# EAGLE design ProtoCard-Prod-V1.0 (EAGLE 7.6.0)
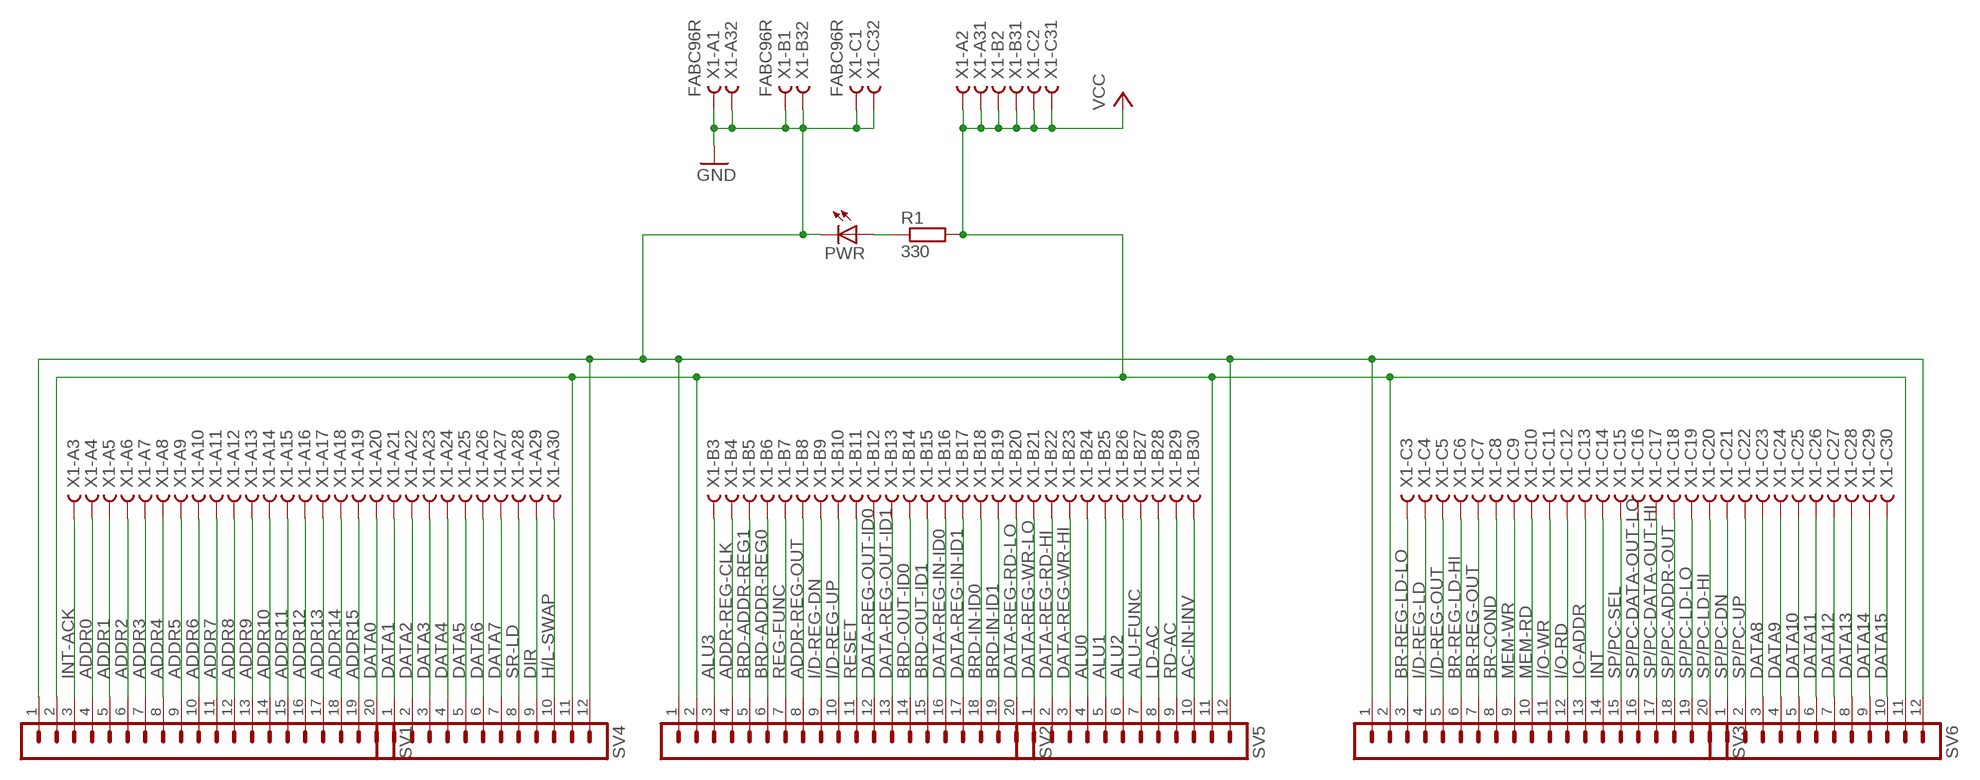
[diagram p0: schematic, sheet 1]

## Parts
PWR  LED5MM  [LED5MM]
R1  330  R0207/10  [0207/10]
SV1  MA20-1  [MA20-1]
SV2  MA20-1  [MA20-1]
SV3  MA20-1  [MA20-1]
SV4  MA12-1  [MA12-1]
SV5  MA12-1  [MA12-1]
SV6  MA12-1  [MA12-1]
X1  FABC96R  [FABC96R]

## Nets
AC-IN-INV: SV5.10 X1.B30
ADDR0: SV1.4 X1.A4
ADDR1: SV1.5 X1.A5
ADDR2: SV1.6 X1.A6
ADDR3: SV1.7 X1.A7
ADDR4: SV1.8 X1.A8
ADDR5: SV1.9 X1.A9
ADDR6: SV1.10 X1.A10
ADDR7: SV1.11 X1.A11
ADDR8: SV1.12 X1.A12
ADDR9: SV1.13 X1.A13
ADDR10: SV1.14 X1.A14
ADDR11: SV1.15 X1.A15
ADDR12: SV1.16 X1.A16
ADDR13: SV1.17 X1.A17
ADDR14: SV1.18 X1.A18
ADDR15: SV1.19 X1.A19
ADDR-REG-CLK: SV2.4 X1.B4
ADDR-REG-OUT: SV2.8 X1.B8
ALU0: SV5.4 X1.B24
ALU1: SV5.5 X1.B25
ALU2: SV5.6 X1.B26
ALU3: SV2.3 X1.B3
ALU-FUNC: SV5.7 X1.B27
BR-COND: SV3.8 X1.C8
BR-REG-LD-HI: SV3.6 X1.C6
BR-REG-LD-LO: SV3.3 X1.C3
BR-REG-OUT: SV3.7 X1.C7
BRD-ADDR-REG0: SV2.6 X1.B6
BRD-ADDR-REG1: SV2.5 X1.B5
BRD-IN-ID0: SV2.18 X1.B18
BRD-IN-ID1: SV2.19 X1.B19
BRD-OUT-ID0: SV2.14 X1.B14
BRD-OUT-ID1: SV2.15 X1.B15
DATA0: SV1.20 X1.A20
DATA1: SV4.1 X1.A21
DATA2: SV4.2 X1.A22
DATA3: SV4.3 X1.A23
DATA4: SV4.4 X1.A24
DATA5: SV4.5 X1.A25
DATA6: SV4.6 X1.A26
DATA7: SV4.7 X1.A27
DATA8: SV6.3 X1.C23
DATA9: SV6.4 X1.C24
DATA10: SV6.5 X1.C25
DATA11: SV6.6 X1.C26
DATA12: SV6.7 X1.C27
DATA13: SV6.8 X1.C28
DATA14: SV6.9 X1.C29
DATA15: SV6.10 X1.C30
DATA-REG-IN-ID0: SV2.16 X1.B16
DATA-REG-IN-ID1: SV2.17 X1.B17
DATA-REG-OUT-ID0: SV2.12 X1.B12
DATA-REG-OUT-ID1: SV2.13 X1.B13
DATA-REG-RD-HI: SV5.2 X1.B22
DATA-REG-RD-LO: SV2.20 X1.B20
DATA-REG-WR-HI: SV5.3 X1.B23
DATA-REG-WR-LO: SV5.1 X1.B21
DIR: SV4.9 X1.A29
GND: PWR.K(C) SV1.1 SV2.1 SV3.1 SV4.12 SV5.12 SV6.12 X1.A1 X1.A32 X1.B1 X1.B32 X1.C1 X1.C32
H/L-SWAP: SV4.10 X1.A30
I/D-REG-DN: SV2.9 X1.B9
I/D-REG-LD: SV3.4 X1.C4
I/D-REG-OUT: SV3.5 X1.C5
I/D-REG-UP: SV2.10 X1.B10
I/O-RD: SV3.12 X1.C12
I/O-WR: SV3.11 X1.C11
INT: SV3.14 X1.C14
INT-ACK: SV1.3 X1.A3
IO-ADDR: SV3.13 X1.C13
LD-AC: SV5.8 X1.B28
MEM-RD: SV3.10 X1.C10
MEM-WR: SV3.9 X1.C9
N$10: PWR.A R1.1
RD-AC: SV5.9 X1.B29
REG-FUNC: SV2.7 X1.B7
RESET: SV2.11 X1.B11
SP/PC-ADDR-OUT: SV3.18 X1.C18
SP/PC-DATA-OUT-HI: SV3.17 X1.C17
SP/PC-DATA-OUT-LO: SV3.16 X1.C16
SP/PC-DN: SV6.1 X1.C21
SP/PC-LD-HI: SV3.20 X1.C20
SP/PC-LD-LO: SV3.19 X1.C19
SP/PC-SEL: SV3.15 X1.C15
SP/PC-UP: SV6.2 X1.C22
SR-LD: SV4.8 X1.A28
VCC: R1.2 SV1.2 SV2.2 SV3.2 SV4.11 SV5.11 SV6.11 X1.A2 X1.A31 X1.B2 X1.B31 X1.C2 X1.C31

## Library data of the parts
PWR = led:LED: LED OSRAM: - CHIPLED LG R971, LG N971, LY N971, LG Q971, LY Q971, LO R971, LY R971 LH N974, LH R974 LS Q976, LO Q976, LY Q976 LO Q996 - Hyper CHIPLED LW Q18S LB Q993, LB Q99A, LB R99A - SideLED LS A670, LO A670, LY A670, LG A670, LP A670 LB A673, LV A673, LT A673, LW A673 LH A674 LY A675 LS A676, LA A676, LO A676, LY A676, LW A676 LS A679, LY A679, LG A679 - Hyper Micro SIDELED® LS Y876, LA Y876, LO Y876, LY Y876 LT Y87S - SmartLED LW L88C, LW L88S LB L89C, LB L89S, LG L890 LS L89K, LO L89K, LY L89K LS L896, LA L896, LO L896, LY L896 - TOPLED LS T670, LO T670, LY T670, LG T670, LP T670 LSG T670, LSP T670, LSY T670, LOP T670, LYG T670 LG T671, LOG T671, LSG T671 LB T673, LV T673, LT T673, LW T673 LH T674 LS T676, LA T676, LO T676, LY T676, LB T676, LH T676, LSB T676, LW T676 LB T67C, LV T67C, LT T67C, LS T67K, LO T67K, LY T67K, LW E67C LS E67B, LA E67B, LO E67B, LY E67B, LB E67C, LV E67C, LT E67C LW T67C LS T679, LY T679, LG T679 LS T770, LO T770, LY T770, LG T770, LP T770 LB T773, LV T773, LT T773, LW T773 LH T774 LS E675, LA E675, LY E675, LS T675 LS T776, LA T776, LO T776, LY T776, LB T776 LHGB T686 LT T68C, LB T68C - Hyper Mini TOPLED® LB M676 - Mini TOPLED Santana® LG M470 LS M47K, LO M47K, LY M47K Source: http://www.osram.convergy.de LUXEON: - LUMILED® LXK2-PW12-R00, LXK2-PW12-S00, LXK2-PW14-U00, LXK2-PW14-V00 LXK2-PM12-R00, LXK2-PM12-S00, LXK2-PM14-U00 LXK2-PE12-Q00, LXK2-PE12-R00, LXK2-PE12-S00, LXK2-PE14-T00, LXK2-PE14-U00 LXK2-PB12-K00, LXK2-PB12-L00, LXK2-PB12-M00, LXK2-PB14-N00, LXK2-PB14-P00, LXK2-PB14-Q00 LXK2-PR12-L00, LXK2-PR12-M00, LXK2-PR14-Q00, LXK2-PR14-R00 LXK2-PD12-Q00, LXK2-PD12-R00, LXK2-PD12-S00 LXK2-PH12-R00, LXK2-PH12-S00 LXK2-PL12-P00, LXK2-PL12-Q00, LXK2-PL12-R00 Source: www.luxeon.com KINGBRIGHT: KA-3528ASYC Source: www.kingbright.com
R1 = eagle-ltspice:R: RESISTOR, European symbol; SPICEMODEL: NONE; SPICEPREFIX: R
SV1-SV3 = con-lstb:MA20-1: PIN HEADER; OC_FARNELL: unknown; OC_NEWARK: unknown
SV4-SV6 = con-lstb:MA12-1: PIN HEADER; OC_FARNELL: unknown; OC_NEWARK: unknown
X1 = con-vg:FABC96R: CONNECTOR female, 96 pins, type R, rows ABC, grid 2.54 mm

## Board
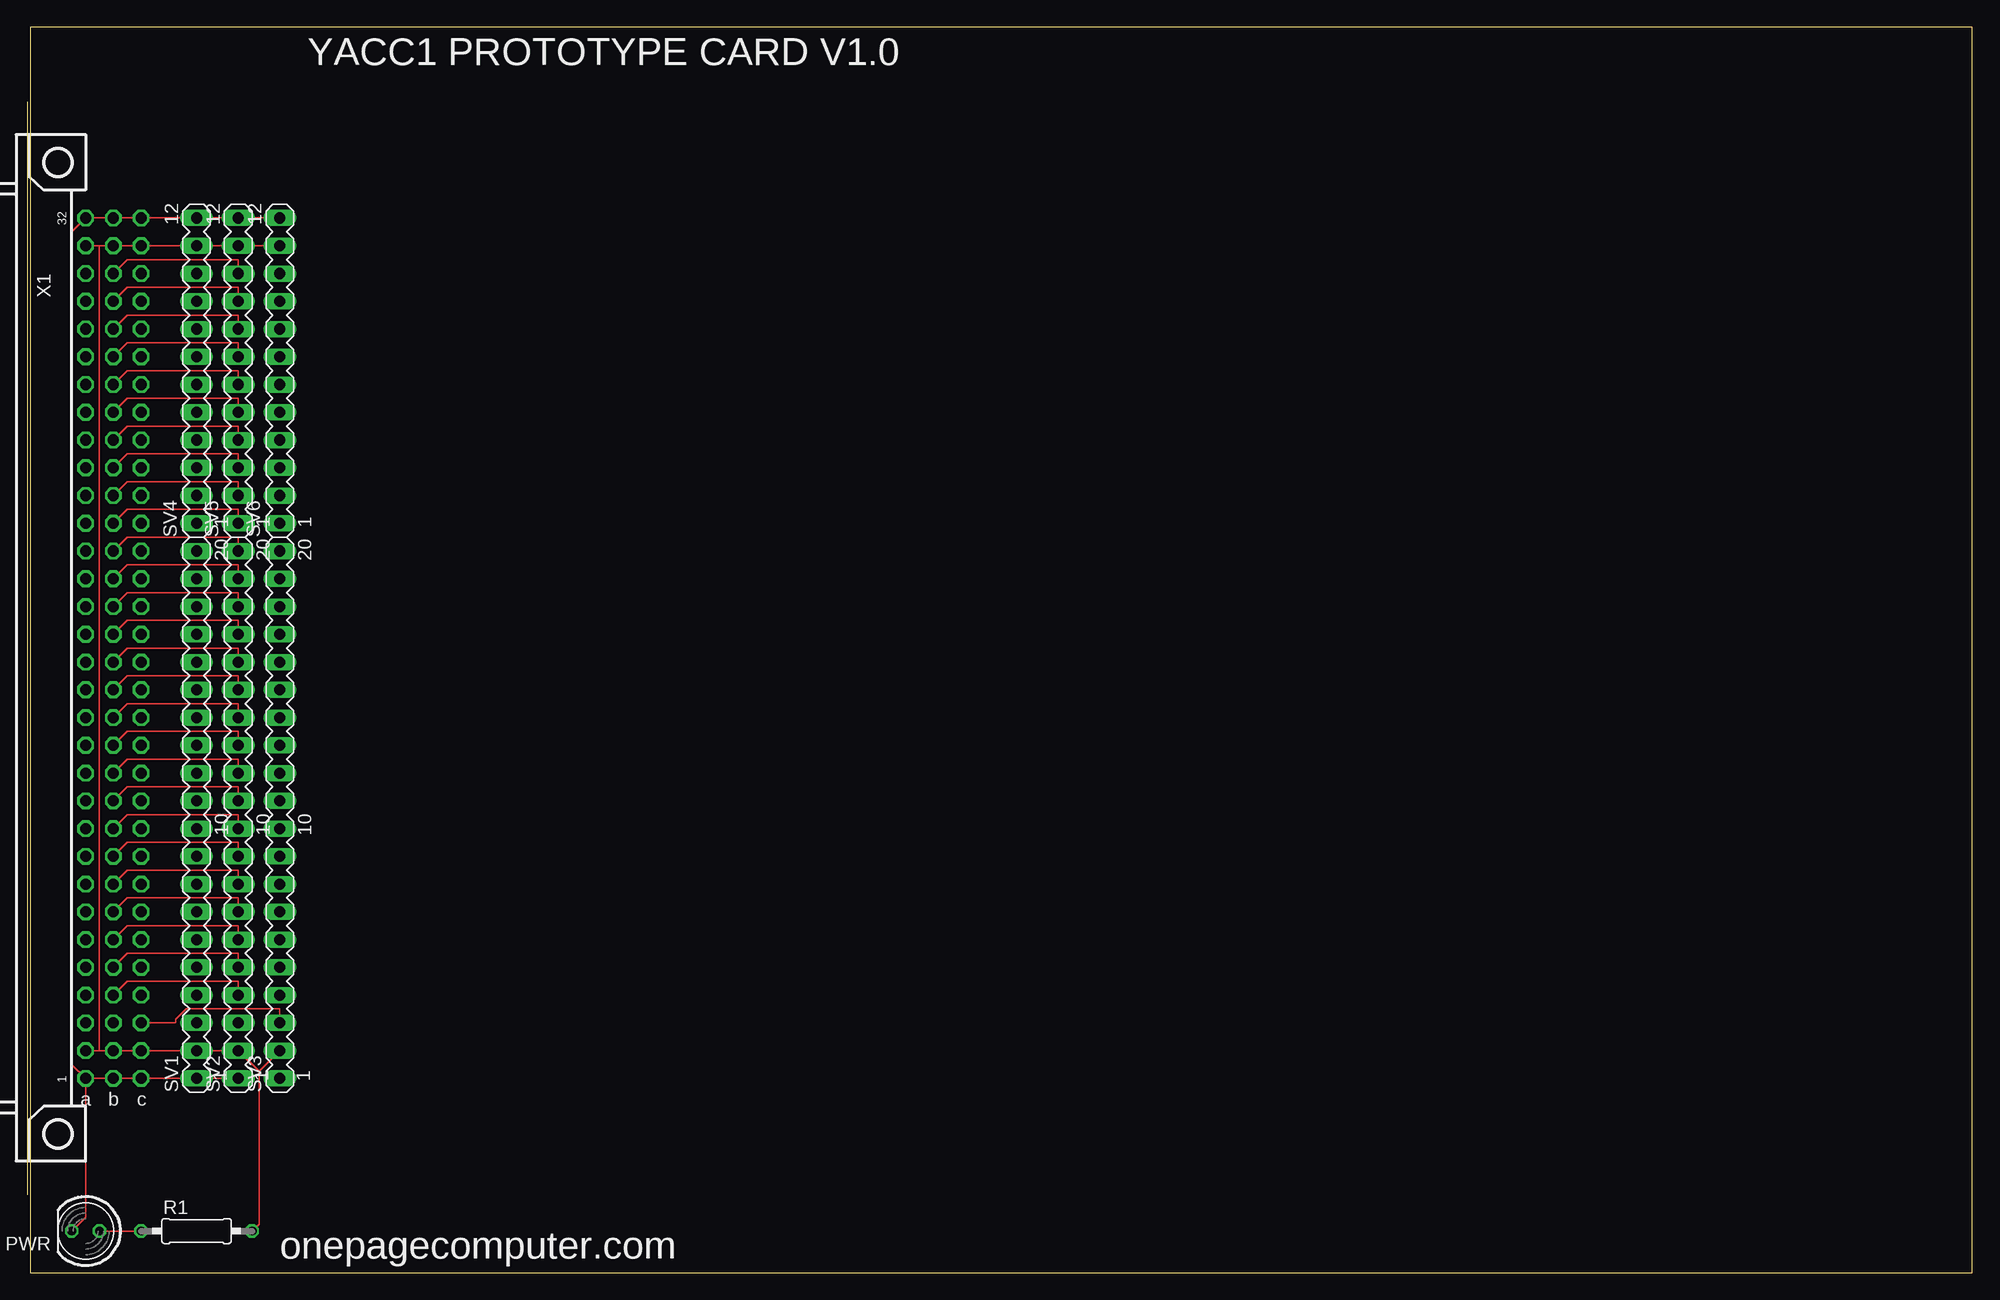
[diagram p1: board, top side]
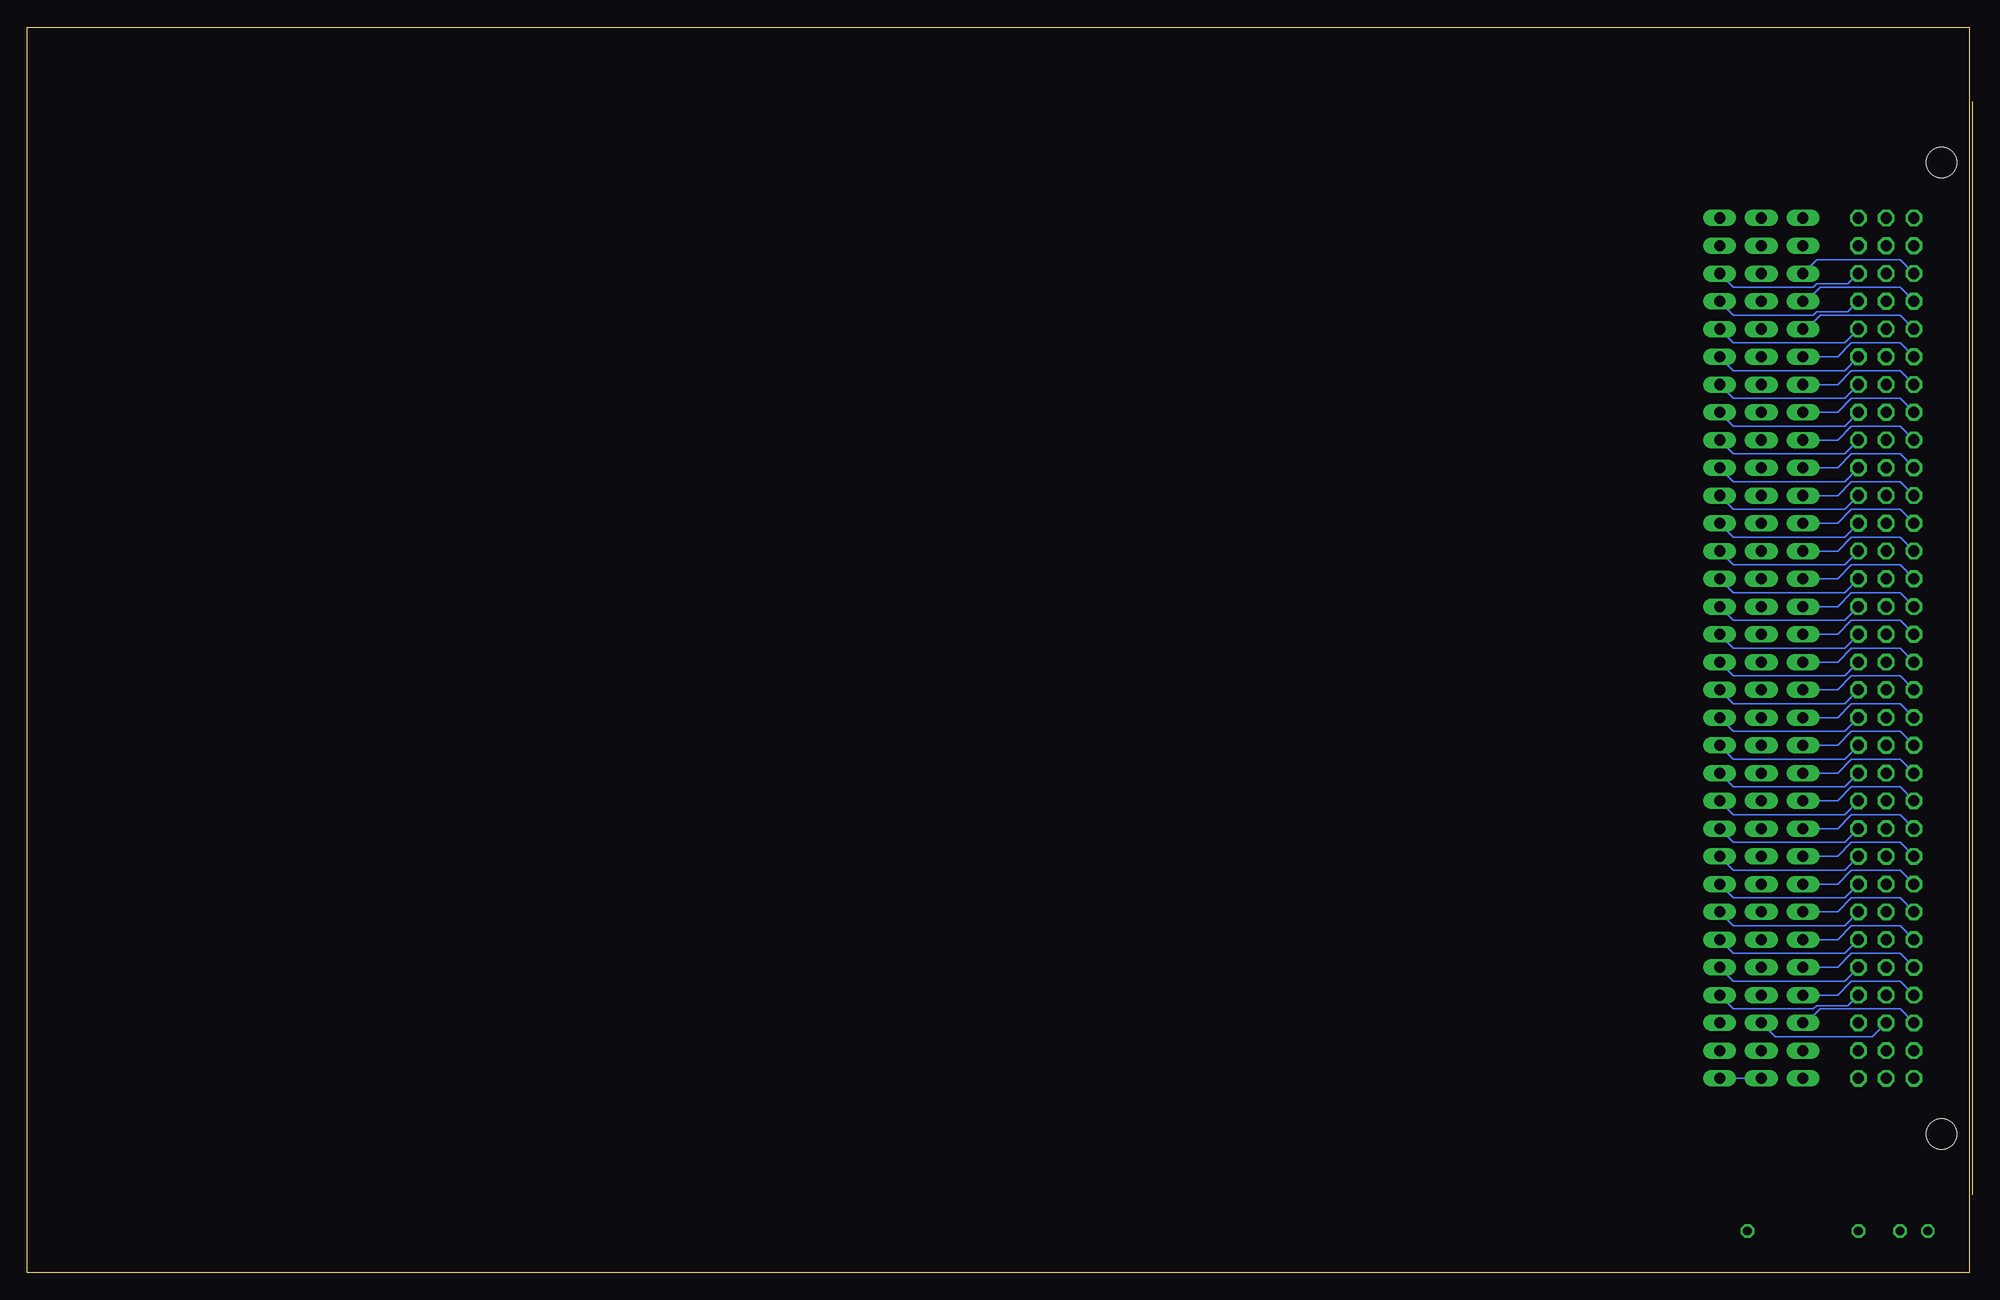
[diagram p2: board, bottom side, seen from below]

Size 177.78 x 113.97 mm. Coordinates in mm from the lower left corner, seen from the top.
Outline: 0,0 177.78,0 177.78,113.97 0,113.97 0,0
Copper layers (1*16): Top 0.0356mm / dielectric 1.5011mm / Bottom 0.0356mm
Design rules "LaenPCBOrder": minimum track width 6mil, minimum drill 13mil, track to track 6mil, track to pad 6mil, pad to pad 6mil, via to via 6mil, smd to smd 6mil, copper to edge 15mil, drill to drill 6mil, minimum pad ring 7mil, minimum via ring 7mil, stop-mask expansion 3mil, vias tented up to drill 0mil, thermal gap 10mil

### Footprints (pad centres in the part's own frame; a part is rotated, then mirrored left to right if it is on the bottom)
LED5MM = drill 0.813 octagon: A -1.27,0; K 1.27,0
0207/10 = drill 0.813 octagon: 1 -5.08,0; 2 5.08,0
MA20-1 = drill 1.016 long: 1 -24.13,0; 2 -21.59,0; 3 -19.05,0; 4 -16.51,0; 5 -13.97,0; 6 -11.43,0; 7 -8.89,0; 8 -6.35,0; 9 -3.81,0; 10 -1.27,0; 11 1.27,0; 12 3.81,0; 13 6.35,0; 14 8.89,0; 15 11.43,0; 16 13.97,0; 17 16.51,0; 18 19.05,0; 19 21.59,0; 20 24.13,0
MA12-1 = drill 1.016 long: 1 -13.97,0; 2 -11.43,0; 3 -8.89,0; 4 -6.35,0; 5 -3.81,0; 6 -1.27,0; 7 1.27,0; 8 3.81,0; 9 6.35,0; 10 8.89,0; 11 11.43,0; 12 13.97,0
FABC96R = drill 1.016 octagon: A1 -2.54,39.37; A2 -2.54,36.83; A3 -2.54,34.29; A4 -2.54,31.75; A5 -2.54,29.21; A6 -2.54,26.67; A7 -2.54,24.13; A8 -2.54,21.59; A9 -2.54,19.05; A10 -2.54,16.51; A11 -2.54,13.97; A12 -2.54,11.43; A13 -2.54,8.89; A14 -2.54,6.35; A15 -2.54,3.81; A16 -2.54,1.27; A17 -2.54,-1.27; A18 -2.54,-3.81; A19 -2.54,-6.35; A20 -2.54,-8.89; A21 -2.54,-11.43; A22 -2.54,-13.97; A23 -2.54,-16.51; A24 -2.54,-19.05; A25 -2.54,-21.59; A26 -2.54,-24.13; A27 -2.54,-26.67; A28 -2.54,-29.21; A29 -2.54,-31.75; A30 -2.54,-34.29; A31 -2.54,-36.83; A32 -2.54,-39.37; B1 -5.08,39.37; B2 -5.08,36.83; B3 -5.08,34.29; B4 -5.08,31.75; B5 -5.08,29.21; B6 -5.08,26.67; B7 -5.08,24.13; B8 -5.08,21.59; B9 -5.08,19.05; B10 -5.08,16.51; B11 -5.08,13.97; B12 -5.08,11.43; B13 -5.08,8.89; B14 -5.08,6.35; B15 -5.08,3.81; B16 -5.08,1.27; B17 -5.08,-1.27; B18 -5.08,-3.81; B19 -5.08,-6.35; B20 -5.08,-8.89; B21 -5.08,-11.43; B22 -5.08,-13.97; B23 -5.08,-16.51; B24 -5.08,-19.05; B25 -5.08,-21.59; B26 -5.08,-24.13; B27 -5.08,-26.67; B28 -5.08,-29.21; B29 -5.08,-31.75; B30 -5.08,-34.29; B31 -5.08,-36.83; B32 -5.08,-39.37; C1 -7.62,39.37; C2 -7.62,36.83; C3 -7.62,34.29; C4 -7.62,31.75; C5 -7.62,29.21; C6 -7.62,26.67; C7 -7.62,24.13; C8 -7.62,21.59; C9 -7.62,19.05; C10 -7.62,16.51; C11 -7.62,13.97; C12 -7.62,11.43; C13 -7.62,8.89; C14 -7.62,6.35; C15 -7.62,3.81; C16 -7.62,1.27; C17 -7.62,-1.27; C18 -7.62,-3.81; C19 -7.62,-6.35; C20 -7.62,-8.89; C21 -7.62,-11.43; C22 -7.62,-13.97; C23 -7.62,-16.51; C24 -7.62,-19.05; C25 -7.62,-21.59; C26 -7.62,-24.13; C27 -7.62,-26.67; C28 -7.62,-29.21; C29 -7.62,-31.75; C30 -7.62,-34.29; C31 -7.62,-36.83; C32 -7.62,-39.37 | hole 2.794: 0,-44.456; 0,44.456

### Placement (x,y rotation side)
PWR  5.08,3.81 180 top
R1  15.24,3.81 0 top
SV1  15.24,41.91 90 top
SV2  19.05,41.91 90 top
SV3  22.86,41.91 90 top
SV4  15.24,82.55 90 top
SV5  19.05,82.55 90 top
SV6  22.86,82.55 90 top
X1  2.54,57.15 180 top

### Tracks (layer width: path | path; a pad name or v marks a point on that pad's centre or on a via)
AC-IN-INV
  Top 0.152: X1.B30 8.89,92.71 19.05,92.71 SV5.10
ADDR0
  Bottom 0.152: X1.A4 6.35,26.67 10.79,26.67 12.06,25.4 SV1.4
ADDR1
  Bottom 0.152: X1.A5 6.35,29.21 10.79,29.21 12.06,27.94 SV1.5
ADDR2
  Bottom 0.152: X1.A6 6.35,31.75 10.79,31.75 12.06,30.48 SV1.6
ADDR3
  Bottom 0.152: X1.A7 6.35,34.29 10.79,34.29 12.06,33.02 SV1.7
ADDR4
  Bottom 0.152: X1.A8 6.35,36.83 10.79,36.83 12.06,35.56 SV1.8
ADDR5
  Bottom 0.152: X1.A9 6.35,39.37 10.79,39.37 12.06,38.1 SV1.9
ADDR6
  Bottom 0.152: X1.A10 6.35,41.91 10.79,41.91 12.06,40.64 SV1.10
ADDR7
  Bottom 0.152: X1.A11 6.35,44.45 10.79,44.45 12.06,43.18 SV1.11
ADDR8
  Bottom 0.152: X1.A12 6.35,46.99 10.79,46.99 12.06,45.72 SV1.12
ADDR9
  Bottom 0.152: X1.A13 6.35,49.53 10.79,49.53 12.06,48.26 SV1.13
ADDR10
  Bottom 0.152: X1.A14 6.35,52.07 10.79,52.07 12.06,50.8 SV1.14
ADDR11
  Bottom 0.152: X1.A15 6.35,54.61 10.79,54.61 12.06,53.34 SV1.15
ADDR12
  Bottom 0.152: X1.A16 6.35,57.15 10.79,57.15 12.06,55.88 SV1.16
ADDR13
  Bottom 0.152: X1.A17 6.35,59.69 10.79,59.69 12.06,58.42 SV1.17
ADDR14
  Bottom 0.152: X1.A18 6.35,62.23 10.79,62.23 12.06,60.96 SV1.18
ADDR15
  Bottom 0.152: X1.A19 6.35,64.77 10.79,64.77 12.06,63.5 SV1.19
ADDR-REG-CLK
  Top 0.152: X1.B4 8.89,26.67 19.05,26.67 SV2.4
ADDR-REG-OUT
  Top 0.152: X1.B8 8.89,36.83 19.05,36.83 SV2.8
ALU0
  Top 0.152: X1.B24 8.89,77.47 19.05,77.47 SV5.4
ALU1
  Top 0.152: X1.B25 8.89,80.01 19.05,80.01 SV5.5
ALU2
  Top 0.152: X1.B26 8.89,82.55 19.05,82.55 SV5.6
ALU3
  Bottom 0.152: X1.B3 8.89,21.59 17.78,21.59 SV2.3
ALU-FUNC
  Top 0.152: X1.B27 8.89,85.09 19.05,85.09 SV5.7
BR-COND
  Bottom 0.152: X1.C8 11.43,34.29 21.59,34.29 SV3.8
BR-REG-LD-HI
  Bottom 0.152: X1.C6 11.43,29.21 21.59,29.21 SV3.6
BR-REG-LD-LO
  Top 0.152: X1.C3 13.34,22.86 13.34,23.18 14.29,24.13 22.86,24.13 SV3.3
BR-REG-OUT
  Bottom 0.152: X1.C7 11.43,31.75 21.59,31.75 SV3.7
BRD-ADDR-REG0
  Top 0.152: X1.B6 8.89,31.75 19.05,31.75 SV2.6
BRD-ADDR-REG1
  Top 0.152: X1.B5 8.89,29.21 19.05,29.21 SV2.5
BRD-IN-ID0
  Top 0.152: X1.B18 8.89,62.23 19.05,62.23 SV2.18
BRD-IN-ID1
  Top 0.152: X1.B19 8.89,64.77 19.05,64.77 SV2.19
BRD-OUT-ID0
  Top 0.152: X1.B14 8.89,52.07 19.05,52.07 SV2.14
BRD-OUT-ID1
  Top 0.152: X1.B15 8.89,54.61 19.05,54.61 SV2.15
DATA0
  Bottom 0.152: X1.A20 6.35,67.31 10.79,67.31 12.06,66.04 SV1.20
DATA1
  Bottom 0.152: X1.A21 6.35,69.85 10.79,69.85 12.06,68.58 SV4.1
DATA2
  Bottom 0.152: X1.A22 6.35,72.39 10.79,72.39 12.06,71.12 SV4.2
DATA3
  Bottom 0.152: X1.A23 6.35,74.93 10.79,74.93 12.06,73.66 SV4.3
DATA4
  Bottom 0.152: X1.A24 6.35,77.47 10.79,77.47 12.06,76.2 SV4.4
DATA5
  Bottom 0.152: X1.A25 6.35,80.01 10.79,80.01 12.06,78.74 SV4.5
DATA6
  Bottom 0.152: X1.A26 6.35,82.55 10.79,82.55 12.06,81.28 SV4.6
DATA7
  Bottom 0.152: X1.A27 6.35,85.09 10.79,85.09 12.06,83.82 SV4.7
DATA8
  Bottom 0.152: X1.C23 11.43,72.39 21.59,72.39 SV6.3
DATA9
  Bottom 0.152: X1.C24 11.43,74.93 21.59,74.93 SV6.4
DATA10
  Bottom 0.152: X1.C25 11.43,77.47 21.59,77.47 SV6.5
DATA11
  Bottom 0.152: X1.C26 11.43,80.01 21.59,80.01 SV6.6
DATA12
  Bottom 0.152: X1.C27 11.43,82.55 21.59,82.55 SV6.7
DATA13
  Bottom 0.152: X1.C28 11.43,85.09 21.59,85.09 SV6.8
DATA14
  Bottom 0.152: X1.C29 11.11,87.95 13.97,87.95 14.29,87.63 21.59,87.63 SV6.9
DATA15
  Bottom 0.152: X1.C30 11.11,90.49 13.97,90.49 14.29,90.17 21.59,90.17 SV6.10
DATA-REG-IN-ID0
  Top 0.152: X1.B16 8.89,57.15 19.05,57.15 SV2.16
DATA-REG-IN-ID1
  Top 0.152: X1.B17 8.89,59.69 19.05,59.69 SV2.17
DATA-REG-OUT-ID0
  Top 0.152: X1.B12 8.89,46.99 19.05,46.99 SV2.12
DATA-REG-OUT-ID1
  Top 0.152: X1.B13 8.89,49.53 19.05,49.53 SV2.13
DATA-REG-RD-HI
  Top 0.152: X1.B22 8.89,72.39 19.05,72.39 SV5.2
DATA-REG-RD-LO
  Top 0.152: X1.B20 8.89,67.31 19.05,67.31 SV2.20
DATA-REG-WR-HI
  Top 0.152: X1.B23 8.89,74.93 19.05,74.93 SV5.3
DATA-REG-WR-LO
  Top 0.152: X1.B21 8.89,69.85 19.05,69.85 SV5.1
DIR
  Bottom 0.152: X1.A29 6.35,90.17 13.65,90.17 14.92,88.9 SV4.9
GND
  Top 0.152: SV6.12 SV5.12 SV4.12 X1.C32 X1.B32 X1.A32 3.81,95.25 3.81,19.05 X1.A1 | SV2.1 SV1.1 X1.C1 X1.B1 X1.A1 | PWR.K 5.08,5.08 X1.A1
  Bottom 0.152: SV2.1 SV3.1
H/L-SWAP
  Bottom 0.152: X1.A30 6.35,92.71 13.97,92.71 SV4.10
I/D-REG-DN
  Top 0.152: X1.B9 8.89,39.37 19.05,39.37 SV2.9
I/D-REG-LD
  Bottom 0.152: X1.C4 11.11,24.45 13.97,24.45 14.29,24.13 21.59,24.13 SV3.4
I/D-REG-OUT
  Bottom 0.152: X1.C5 11.43,26.67 21.59,26.67 SV3.5
I/D-REG-UP
  Top 0.152: X1.B10 8.89,41.91 19.05,41.91 SV2.10
I/O-RD
  Bottom 0.152: X1.C12 11.43,44.45 21.59,44.45 SV3.12
I/O-WR
  Bottom 0.152: X1.C11 11.43,41.91 21.59,41.91 SV3.11
INT
  Bottom 0.152: X1.C14 11.43,49.53 21.59,49.53 SV3.14
INT-ACK
  Bottom 0.152: X1.A3 6.35,24.13 13.65,24.13 14.92,22.86 SV1.3
IO-ADDR
  Bottom 0.152: X1.C13 11.43,46.99 21.59,46.99 SV3.13
LD-AC
  Top 0.152: X1.B28 8.89,87.63 19.05,87.63 SV5.8
MEM-RD
  Bottom 0.152: X1.C10 11.43,39.37 21.59,39.37 SV3.10
MEM-WR
  Bottom 0.152: X1.C9 11.43,36.83 21.59,36.83 SV3.9
N$10
  Top 0.152: R1.1 PWR.A
RD-AC
  Top 0.152: X1.B29 8.89,90.17 19.05,90.17 SV5.9
REG-FUNC
  Top 0.152: X1.B7 8.89,34.29 19.05,34.29 SV2.7
RESET
  Top 0.152: X1.B11 8.89,44.45 19.05,44.45 SV2.11
SP/PC-ADDR-OUT
  Bottom 0.152: X1.C18 11.43,59.69 21.59,59.69 SV3.18
SP/PC-DATA-OUT-HI
  Bottom 0.152: X1.C17 11.43,57.15 21.59,57.15 SV3.17
SP/PC-DATA-OUT-LO
  Bottom 0.152: X1.C16 11.43,54.61 21.59,54.61 SV3.16
SP/PC-DN
  Bottom 0.152: X1.C21 11.43,67.31 21.59,67.31 SV6.1
SP/PC-LD-HI
  Bottom 0.152: X1.C20 11.43,64.77 21.59,64.77 SV3.20
SP/PC-LD-LO
  Bottom 0.152: X1.C19 11.43,62.23 21.59,62.23 SV3.19
SP/PC-SEL
  Bottom 0.152: X1.C15 11.43,52.07 21.59,52.07 SV3.15
SP/PC-UP
  Bottom 0.152: X1.C22 11.43,69.85 21.59,69.85 SV6.2
SR-LD
  Bottom 0.152: X1.A28 6.35,87.63 13.65,87.63 14.92,86.36 SV4.8
VCC
  Top 0.152: 6.35,93.98 X1.B31 X1.C31 SV4.11 SV5.11 SV6.11 | 6.35,93.98 X1.A31 | 6.35,20.32 X1.B2 X1.C2 SV1.2 SV2.2 20.95,18.41 | 6.35,20.32 X1.A2 | R1.2 20.95,4.45 20.95,18.41 | SV3.2 20.95,18.41 | 6.35,20.32 6.35,93.98

### Text on the board
tNames: YACC1 PROTOTYPE CARD V1.0 | onepagecomputer.com